# Altium schematic sheet Main.SchDoc
size A4; Organization: Altium Limited; Address1: L3, 12a Rodborough Rd; Address2: Frenchs Forest; Address3: NSW; Address4: Australia 2086; SheetNumber: 1; SheetTotal: 2
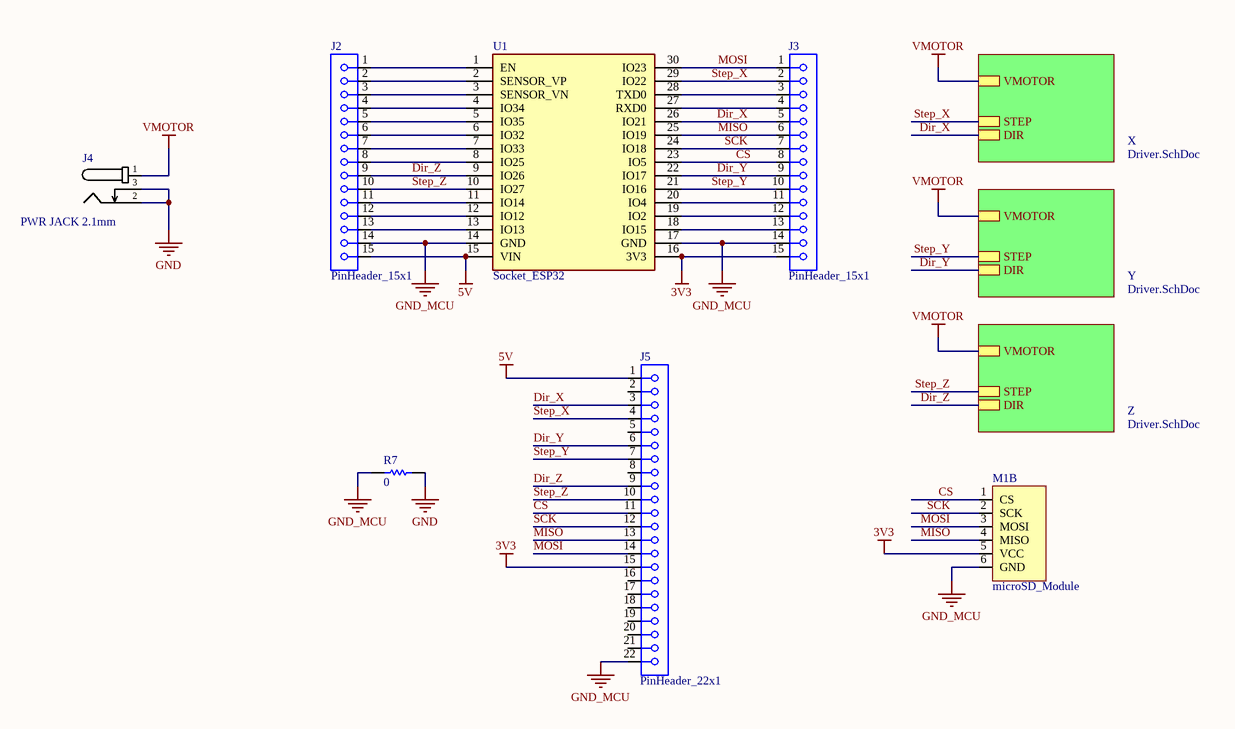
[diagram p0: Main.SchDoc]

## Parts
J2  PinHeader_15x1  [PinHead_15x1]
J3  PinHeader_15x1  [PinHead_15x1]
J4  PWR JACK 2.1mm  [CON_POWER_BARREL_2.1MM_3CONN]
J5  PinHeader_22x1  [PinHead_22x1]
M1  microSD_Module  [MicroSD_Module_Vertical]  (part B of 2)
R7  value 0  [RES_0805]  (hidden comment: RES SMD 0 OHM JUMPER 1/8W 0805)
U1  Socket_ESP32  [Socket_ESP32]

## Sub-sheets
X = Driver.SchDoc: VMOTOR, STEP, DIR
Y = Driver.SchDoc: VMOTOR, STEP, DIR
Z = Driver.SchDoc: VMOTOR, STEP, DIR

## Nets
3V3: J3.15 J5.15 M1.5(VCC) U1.16(3V3)
5V: J2.15 J5.1 U1.15(VIN)
GND: J4.2 J4.3 R7.2
GND_MCU: J2.14 J3.14 J5.22 M1.6(GND) R7.1 U1.14(GND) U1.17(GND)
VMOTOR: J4.1 ; sheet X/VMOTOR, sheet Y/VMOTOR, sheet Z/VMOTOR
CS: J3.8 J5.11 M1.1(CS) U1.23(IO5)
Dir_X: J3.5 J5.3 U1.26(IO21) ; sheet X/DIR
Dir_Y: J3.9 J5.6 U1.22(IO17) ; sheet Y/DIR
Dir_Z: J2.9 J5.9 U1.9(IO26) ; sheet Z/DIR
MISO: J3.6 J5.13 M1.4(MISO) U1.25(IO19)
MOSI: J3.1 J5.14 M1.3(MOSI) U1.30(IO23)
SCK: J3.7 J5.12 M1.2(SCK) U1.24(IO18)
Step_X: J3.2 J5.4 U1.29(IO22) ; sheet X/STEP
Step_Y: J3.10 J5.7 U1.21(IO16) ; sheet Y/STEP
Step_Z: J2.10 J5.10 U1.10(IO27) ; sheet Z/STEP
NetJ2_1: J2.1 U1.1(EN)
NetJ2_2: J2.2 U1.2(SENSOR_VP)
NetJ2_3: J2.3 U1.3(SENSOR_VN)
NetJ2_4: J2.4 U1.4(IO34)
NetJ2_5: J2.5 U1.5(IO35)
NetJ2_6: J2.6 U1.6(IO32)
NetJ2_7: J2.7 U1.7(IO33)
NetJ2_8: J2.8 U1.8(IO25)
NetJ2_11: J2.11 U1.11(IO14)
NetJ2_12: J2.12 U1.12(IO12)
NetJ2_13: J2.13 U1.13(IO13)
NetJ3_3: J3.3 U1.28(TXD0)
NetJ3_4: J3.4 U1.27(RXD0)
NetJ3_11: J3.11 U1.20(IO4)
NetJ3_12: J3.12 U1.19(IO2)
NetJ3_13: J3.13 U1.18(IO15)

Not connected (* = marked no-connect by the designer): J5 2 5 8 16 17 18 19 20 21

## Notes on the sheet
- Title
- Size:
- Date:
- A4
- Number:
- Time:
- Revision:
- Sheet
- of
- File:

## Library data of the parts
J4 = Con_Power_Jack_2.1mm_3pins: CONN PWR JACK 2X5.5MM SOLDER; Manufacturer: HCTL; Manufacturer Part Number: HC-DC-005-2.0T; Supplier 1: LCSC; Supplier Part Number 1: C3010533; ComponentLink1Description: LCSC; ComponentLink1URL: https://www.lcsc.com/product-detail/AC-DC-Power-Connectors_HCTL-HC-DC-005-2-0T_C3010533.html
R7 = RES_0_0805: 0 Ohms Jumper 0.25W, 1/4W Chip Resistor 0805 (2012 Metric) Automotive AEC-Q200 Thick Film; Manufacturer: Vishay Dale; Manufacturer Part Number: CRCW08050000Z0EA; Supplier 1: Digi-key; Supplier Part Number 1: 541-0.0ACT-ND; ComponentLink1Description: Digi-key; ComponentLink1URL: https://www.digikey.com/en/products/detail/bourns-inc/CRF1206-FZ-R001ELF/16357891?s=N4IgTCBcDaIMICUBiBGMAGAbAWiQLWwXXRQFEAZJEAXQF8g; ComponentLink2Description: Mouser; ComponentLink2URL: https://www.mouser.com/ProductDetail/Bourns/CRF1206-FZ-R001ELF?qs=gZXFycFWdAMpF6uWjGzGSg%3D%3D&utm_source=octopart&utm_medium=aggregator&utm_campaign=652-CRF1206FZR001ELF&utm_content=Bourns